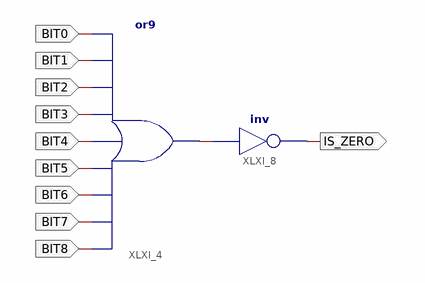
[diagram p0: schematic sheet 1]
// Xilinx ISE schematic ZeroChecker.sch (spartan6) as structural Verilog: 2 symbols, 10 ports
module ZeroChecker (
  input  BIT7,
  input  BIT6,
  input  BIT5,
  input  BIT4,
  input  BIT3,
  input  BIT2,
  input  BIT1,
  input  BIT0,
  input  BIT8,
  output IS_ZERO
);

  wire XLXN_15;

  or XLXI_4 (XLXN_15, BIT8, BIT7, BIT6, BIT5, BIT4, BIT3, BIT2, BIT1, BIT0);
  not XLXI_8 (IS_ZERO, XLXN_15);
endmodule
